# EAGLE design display (EAGLE 9.0.0)
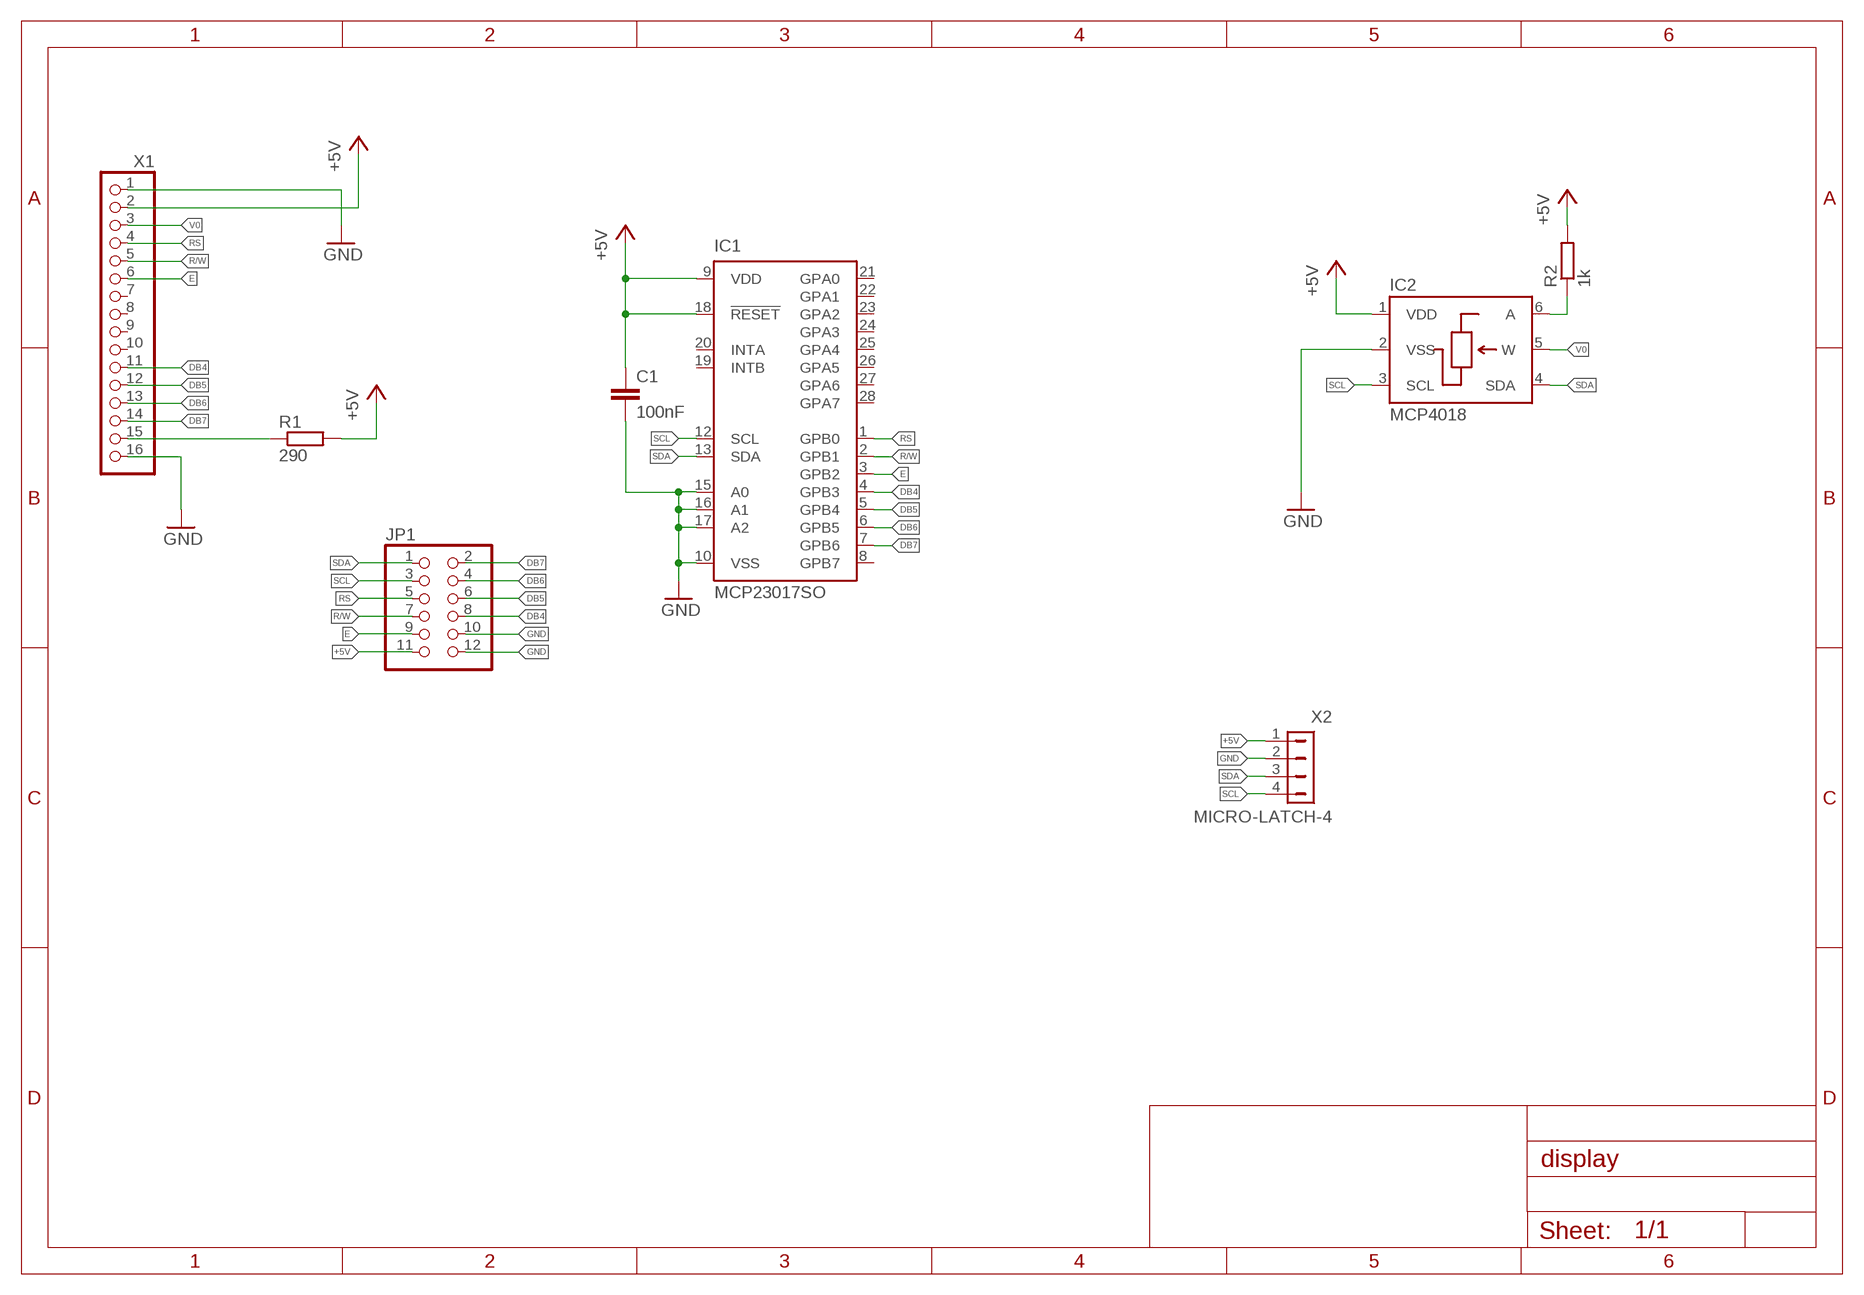
[diagram p0: schematic, sheet 1]

## Parts
C1  100nF  C-EUC0805  [C0805]
IC1  MCP23017SO  [SO28W]
IC2  MCP4018  [SC70-6L]
JP1  PINHD-2X6  [2X06]
R1  290  R-EU_R0805  [R0805]
R2  1k  R-EU_R0805  [R0805]
X1  PINHD-1X16  [1X16]
X2  MICRO-LATCH-4  [MICRO-LATCH-4]

## Nets
+5V: C1.1 IC1.9(VDD) IC1.18(!RESET) IC2.1(VDD) JP1.11 R1.2 R2.2 X1.2 X2.1
DB4: IC1.4(GPB3) JP1.8 X1.11
DB5: IC1.5(GPB4) JP1.6 X1.12
DB6: IC1.6(GPB5) JP1.4 X1.13
DB7: IC1.7(GPB6) JP1.2 X1.14
E: IC1.3(GPB2) JP1.9 X1.6
GND: C1.2 IC1.10(VSS) IC1.15(A0) IC1.16(A1) IC1.17(A2) IC2.2(VSS) JP1.10 JP1.12 X1.1 X1.16 X2.2
N$15: R1.1 X1.15
N$24: IC2.6(A) R2.1
R/W: IC1.2(GPB1) JP1.7 X1.5
RS: IC1.1(GPB0) JP1.5 X1.4
SCL: IC1.12(SCL) IC2.3(SCL) JP1.3 X2.4
SDA: IC1.13(SDA) IC2.4(SDA) JP1.1 X2.3
V0: IC2.5(W) X1.3
Unconnected: IC1.8(GPB7) IC1.19(INTB) IC1.20(INTA) IC1.21(GPA0) IC1.22(GPA1) IC1.23(GPA2) IC1.24(GPA3) IC1.25(GPA4) IC1.26(GPA5) IC1.27(GPA6) IC1.28(GPA7) X1.7 X1.8 X1.9 X1.10

## Library data of the parts
C1 = rcl:C-EU: CAPACITOR, European symbol; SPICEPREFIX: C
IC1 = microchip:MCP23017: http://ww1.microchip.com/downloads/en/DeviceDoc/21952a.pdf Source: http://ww1.microchip.com/downloads/en/DeviceDoc/21952a.pdf; MF: MICROCHIP; MPN: MCP23017-E/SO; OC_FARNELL: 1332087; OC_NEWARK: 31K2958
IC2 = solderpi:MCP4018
JP1 = pinhead:PINHD-2X6: PIN HEADER
R1 R2 = rcl:R-EU_: RESISTOR, European symbol; SPICEPREFIX: R
X1 = solderpi:PINHD-1X16: PIN HEADER
X2 = solderpi:MICRO-LATCH-4

## Net classes
0 default: width 0.254 mm, clearance 0.254 mm

## Board
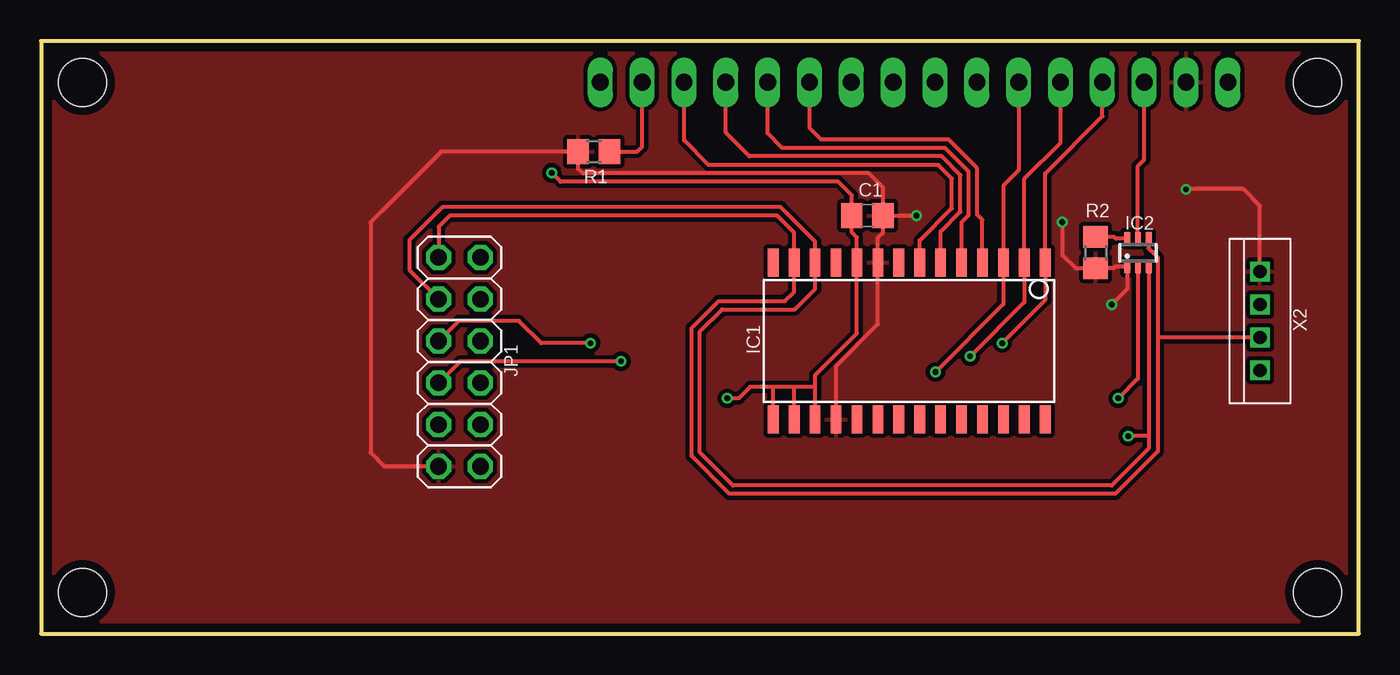
[diagram p1: board, top side]
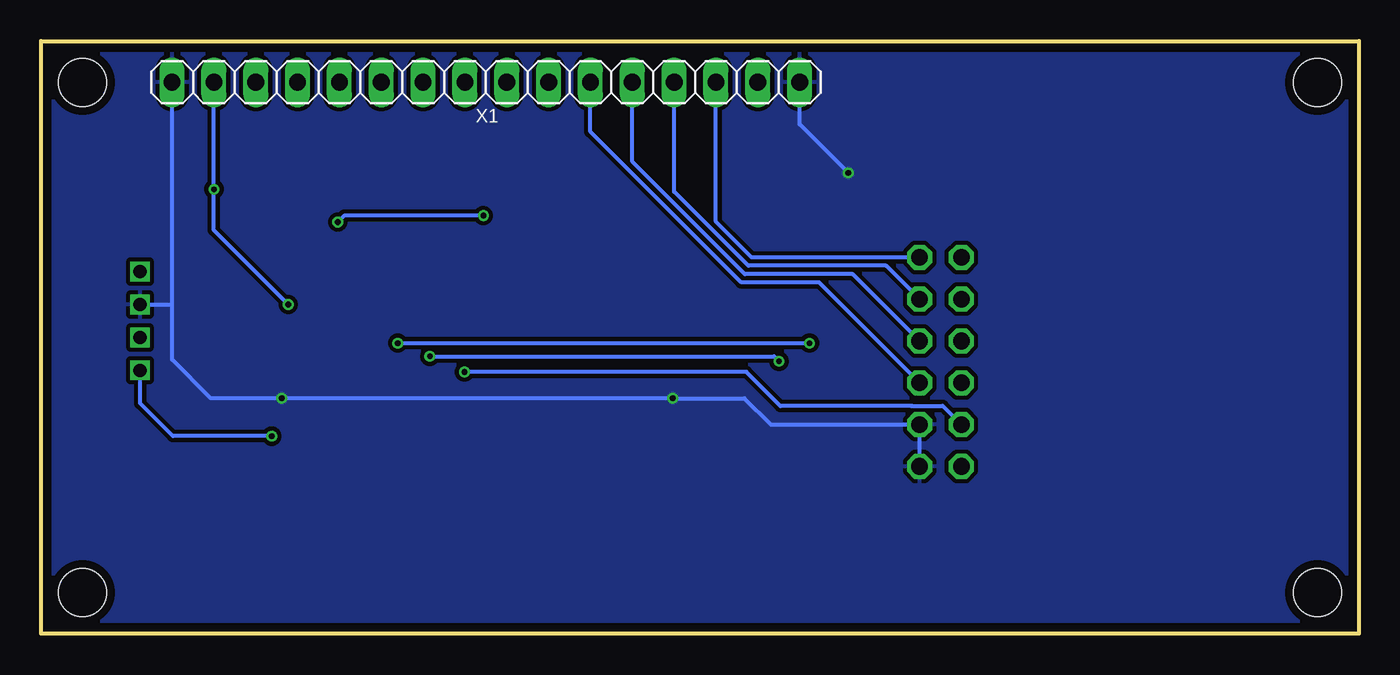
[diagram p2: board, bottom side, seen from below]

Size 80 x 36 mm. Coordinates in mm from the lower left corner, seen from the top.
Outline: 80,36 0,36 0,0 80,0 80,36
Copper layers (1*16): Top 0.035mm / dielectric 1.6mm / Bottom 0.035mm
Design rules "Elecrow_2-layer_PCB_eagle_rule": minimum track width 6mil, minimum drill 12mil, track to track 6mil, track to pad 6mil, pad to pad 6mil, via to via 8mil, smd to smd 0mil, copper to edge 20mil, drill to drill 10mil, minimum pad ring 6mil, minimum via ring 6mil, stop-mask expansion 0mil, vias tented up to drill 100mil, thermal gap 10mil
Holes 2.9 mm at 77.5,2.5 2.5,2.5 77.5,33.5 2.5,33.5

### Footprints (pad centres in the part's own frame; a part is rotated, then mirrored left to right if it is on the bottom)
C0805 = smd 1.3 x 1.5: 1 -0.95,0; 2 0.95,0
SO28W = smd 0.65 x 1.7: 1 -7.62,-4.78; 2 -6.35,-4.78; 3 -5.08,-4.78; 4 -3.81,-4.78; 5 -2.54,-4.78; 6 -1.27,-4.78; 7 0,-4.78; 8 1.27,-4.78; 9 2.54,-4.78; 10 3.81,-4.78; 11 5.08,-4.78; 12 6.35,-4.78; 13 7.62,-4.78; 14 8.89,-4.78; 15 8.89,4.78; 16 7.62,4.78; 17 6.35,4.78; 18 5.08,4.78; 19 3.81,4.78; 20 2.54,4.78; 21 1.27,4.78; 22 0,4.78; 23 -1.27,4.78; 24 -2.54,4.78; 25 -3.81,4.78; 26 -5.08,4.78; 27 -6.35,4.78; 28 -7.62,4.78
SC70-6L = smd 0.35 x 0.8: 1 -0.65,-0.85; 2 0,-0.85; 3 0.65,-0.85; 4 0.65,0.85; 5 0,0.85; 6 -0.65,0.85
2X06 = drill 1.016 octagon: 1 -6.35,-1.27; 2 -6.35,1.27; 3 -3.81,-1.27; 4 -3.81,1.27; 5 -1.27,-1.27; 6 -1.27,1.27; 7 1.27,-1.27; 8 1.27,1.27; 9 3.81,-1.27; 10 3.81,1.27; 11 6.35,-1.27; 12 6.35,1.27
R0805 = smd 1.3 x 1.5: 1 -0.95,0; 2 0.95,0
1X16 = drill 1.016 long: 1 -19.05,0; 2 -16.51,0; 3 -13.97,0; 4 -11.43,0; 5 -8.89,0; 6 -6.35,0; 7 -3.81,0; 8 -1.27,0; 9 1.27,0; 10 3.81,0; 11 6.35,0; 12 8.89,0; 13 11.43,0; 14 13.97,0; 15 16.51,0; 16 19.05,0
MICRO-LATCH-4 = drill 0.8 square: 1 -3,0; 2 -1,0; 3 1,0; 4 3,0

### Placement (x,y rotation side)
C1  50.16,25.4 180 top
IC1  53.34,17.78 180 top
IC2  66.59,23.15 0 top
JP1  25.4,16.51 270 top
R1  33.55,29.29 180 top
R2  64.02,23.15 270 top
X1  53,33.5 0 bottom
X2  74,19 270 top

### Tracks (layer width: path | path; a pad name or v marks a point on that pad's centre or on a via)
+5V  (via drill 0.35)
  Top 0.254: C1.1 51.12,24.36 50.8,24.05 IC1.9 50.8,18.8 48.26,16.26 IC1.18 | C1.1 51.12,27.1 50.25,27.97 32.88,27.97 32.6,28.25 R1.2 24.29,29.29 20,25 20,11 20.84,10.16 JP1.11 | v65,20 65.94,20.94 IC2.1 65.2,22.3 65.1,22.2 R2.2 62.8,22.2 62,23 v62,25 | C1.1 v53.15,25.4 | X2.1 74,26 73,27 v69.51,27
  Bottom 0.254: v53.15,25.4 61.6,25.4 v62,25 | X1.2 v69.51,27 69.51,24.51 v65,20
  pour Top: 0,36 80,36 80,0 0,0
DB4
  Top 0.254: IC1.4 57.15,25.15 56.82,25.48 56.82,28.28 55.09,30.02 47.35,30.02 46.65,30.72 X1.11
  Bottom 0.254: JP1.8 32.77,21.34 37.49,21.34 46.65,30.5 X1.11
DB5
  Top 0.254: IC1.5 55.88,24.99 56.32,25.43 56.32,28.07 54.88,29.51 45,29.51 44.11,30.4 X1.12
  Bottom 0.254: JP1.6 30.73,21.84 37.28,21.84 44.11,28.67 X1.12
DB6
  Top 0.254: IC1.6 54.61,24.44 55.81,25.64 55.81,27.86 54.67,29 43,29 41.57,30.43 X1.13
  Bottom 0.254: JP1.4 28.7,22.35 37.07,22.35 41.57,26.85 X1.13
DB7
  Top 0.254: IC1.7 53.34,23.89 55.3,25.85 55.3,27.65 54.47,28.48 40.52,28.48 39.03,29.97 X1.14
  Bottom 0.254: JP1.2 36.86,22.86 39.03,25.03 X1.14
E  (via drill 0.35)
  Top 0.254: v54.3,15.9 58.42,20.02 IC1.3 58.42,27.22 59.35,28.15 X1.6
  Bottom 0.254: JP1.9 25.27,13.84 27.14,13.84 27.15,13.83 35.12,13.83 37.18,15.9 v54.3,15.9
GND  (via drill 0.35)
  Top 0.254: IC1.17 46.99,15 | 46.99,15 46.99,15.71 49.53,18.25 IC1.10 49.53,24.07 49.22,24.39 C1.2 49.22,26.64 48.4,27.46 31.54,27.46 v31,28 | 46.99,15 45.75,15 | 45.75,15 44.45,15 | 44.45,15 43.05,15 42.35,14.3 v41.65,14.3 | IC1.16 45.72,14.97 45.75,15 | IC1.15 44.45,15 | IC2.2 66.59,15.49 v65.4,14.3
  Bottom 0.254: 72.05,20 72.05,16.65 69.7,14.3 v65.4,14.3 v41.65,14.3 37.3,14.3 35.7,12.7 JP1.10 JP1.12 | 72.05,20 X1.1 | v31,28 33.95,30.95 X1.16 | X2.2 72.05,20
  pour Bottom: 0,36 80,36 80,0 0,0
N$15
  Top 0.254: R1.1 36.19,29.29 36.49,29.59 X1.15
N$24
  Top 0.254: IC2.6 65.25,24 65.15,24.1 R2.1
R/W  (via drill 0.35)
  Top 0.254: v56.4,16.85 59.69,20.14 IC1.2 59.69,27.64 61.89,29.84 X1.5 | v35.2,16.55 25.44,16.55 JP1.7
  Bottom 0.254: v35.2,16.55 35.5,16.85 v56.4,16.85
RS  (via drill 0.35)
  Top 0.254: v58.35,17.65 60.96,20.26 IC1.1 60.96,27.96 64.43,31.43 X1.4 | v33.35,17.65 30.35,17.65 29,19 25.35,19 JP1.5
  Bottom 0.254: v58.35,17.65 v33.35,17.65
SCL  (via drill 0.35)
  Top 0.254: IC2.3 67.24,12 | 67.24,12 67.24,11.24 65,9 42,9 40,11 40,18.35 41.35,19.7 45.75,19.7 46.99,20.94 IC1.12 46.99,23.83 44.91,25.91 24.36,25.91 22.35,23.9 22.35,22.1 JP1.3 | 67.24,12 v66,12
  Bottom 0.254: v66,12 72,12 74,14 X2.4
SDA
  Top 0.254: IC2.4 67.24,23.41 67.57,23.08 67.8,22.86 67.8,18 | 67.8,18 67.8,11.08 65.21,8.49 41.79,8.49 39.49,10.79 39.49,18.56 41.14,20.21 45.16,20.21 45.72,20.77 IC1.13 45.72,24.38 44.7,25.4 24.8,25.4 24.13,24.73 JP1.1 | X2.3 67.8,18
V0
  Top 0.254: IC2.5 66.59,28.41 66.97,28.79 X1.3